# Altium schematic sheet 04_Input.SchDoc
size A; SheetNumber: 4; SheetTotal: 8
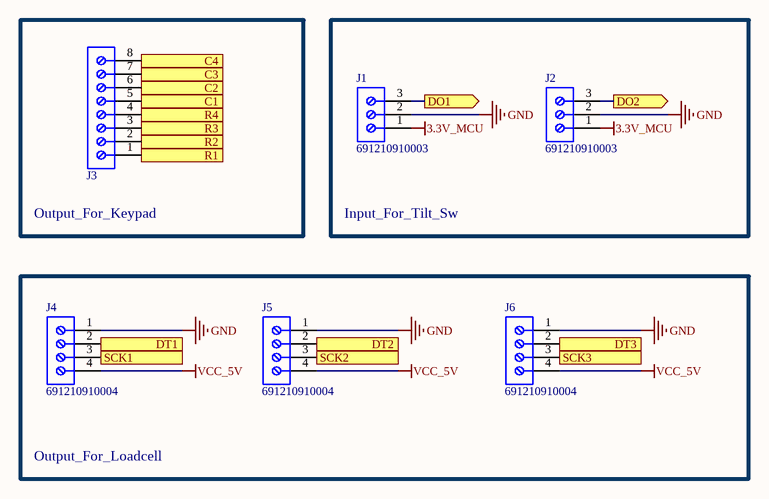
[diagram p0: 04_Input.SchDoc]

## Parts
J1  691210910003  [691210910003]
J2  691210910003  [691210910003]
J3  691210910008  [691210910008]  (value not drawn)
J4  691210910004  [691210910004]
J5  691210910004  [691210910004]
J6  691210910004  [691210910004]

## Blocks framed on the sheet
Output_For_Keypad: J3
Input_For_Tilt_Sw: J1 J2
Output_For_Loadcell: J4-J6

## Ports
C1 (out), C2 (out), C3 (out), C4 (out), DO1 (out), DO2 (out), DT1 (out), DT2 (out), DT3 (out), R1 (out), R2 (out), R3 (out), R4 (out), SCK1 (out), SCK2 (out), SCK3 (out)

## Nets
3.3V_MCU: J1.1 J2.1
GND: J1.2 J2.2 J4.1 J5.1 J6.1
VCC_5V: J4.4 J5.4 J6.4
C1: J3.5 ; port C1
C2: J3.6 ; port C2
C3: J3.7 ; port C3
C4: J3.8 ; port C4
DO1: J1.3 ; port DO1
DO2: J2.3 ; port DO2
DT1: J4.2 ; port DT1
DT2: J5.2 ; port DT2
DT3: J6.2 ; port DT3
R1: J3.1 ; port R1
R2: J3.2 ; port R2
R3: J3.3 ; port R3
R4: J3.4 ; port R4
SCK1: J4.3 ; port SCK1
SCK2: J5.3 ; port SCK2
SCK3: J6.3 ; port SCK3

## Library data of the parts
J1 J2 = 691210910003: WR-TBL Serie 2109 Horizontal Entry, Rising Cage Clamp, pitch 2.54mm, 3p; Compliance: Lead free / RoHS; Modularity: No; PCB/Cable/Panel: PCB; Pin Number: 3; Rated Current [UL]: 6A; Working Voltage [UL]: 150VAC; No. Pad (SMD): 0; ComponentLink1Description: Manufacturer; ComponentLink1URL: http://www.we-online.de; ComponentLink2URL: https://katalog.we-online.de/em/datasheet/691210910003.pdf; ComponentLink2Description: Datasheet; Mounting Technology: THT; Part Number: 691210910003; Packaging: Box; Operating Temperature: -40 to +105degC; Pitch: 2.54mm; Published Date: October 2019; Type: Horizontal; Publisher: Wurth Elektronik; Application: Rising Cage Clamp; No. Pad (THT): 3; Unit Price (Digikey): 1.55
J3 = 691210910008: WR-TBL Series 2109 Horizontal Entry, Through Hole, pitch 2.54mm, 8p; Manufacturer: Wurth Elektronik; Pin Number: 8; Rated Current: 6A; Working Voltage: 150V; PCB/Cable/Panel: PCB; Modularity: No; No. Pad (SMD): 0; ComponentLink1Description: Manufacturer Link; ComponentLink1URL: https://www.we-online.com/redexpert/article/691210910008?ad; ComponentLink2Description: Datasheet; ComponentLink2URL: https://www.we-online.com/redexpert/spec/691210910008?ad; Category: Terminal Blocks; Match Code: WR-TBL; Manufacturer Part Number: 691210910008; Mount: Through Hole; Operating Temperature Max: 105°C; Operating Temperature Min: -40°C; Packaging: Box; Pitch: 2.54mm; Orientation: Horizontal; Application: Rising Cage Clamp; No. Pad (THT): 8; Unit Price (Digikey): 3.93
J4-J6 = 691210910004: WR-TBL Serie 2109 Horizontal Entry, Rising Cage Clamp, pitch 2.54mm, 4p; Compliance: Lead free / RoHS; Modularity: No; PCB/Cable/Panel: PCB; Pin Number: 4; Rated Current [UL]: 6A; Working Voltage [UL]: 150VAC; No. Pad (SMD): 0; ComponentLink1Description: Manufacturer; ComponentLink1URL: http://www.we-online.de; ComponentLink2URL: https://katalog.we-online.de/em/datasheet/691210910004.pdf; ComponentLink2Description: Datasheet; Mounting Technology: THT; Part Number: 691210910004; Packaging: Box; Operating Temperature: -40 to +105degC; Pitch: 2.54mm; Published Date: October 2019; Type: Horizontal; Publisher: Wurth Elektronik; Application: Rising Cage Clamp; No. Pad (THT): 4; Unit Price (Digikey): 1.96